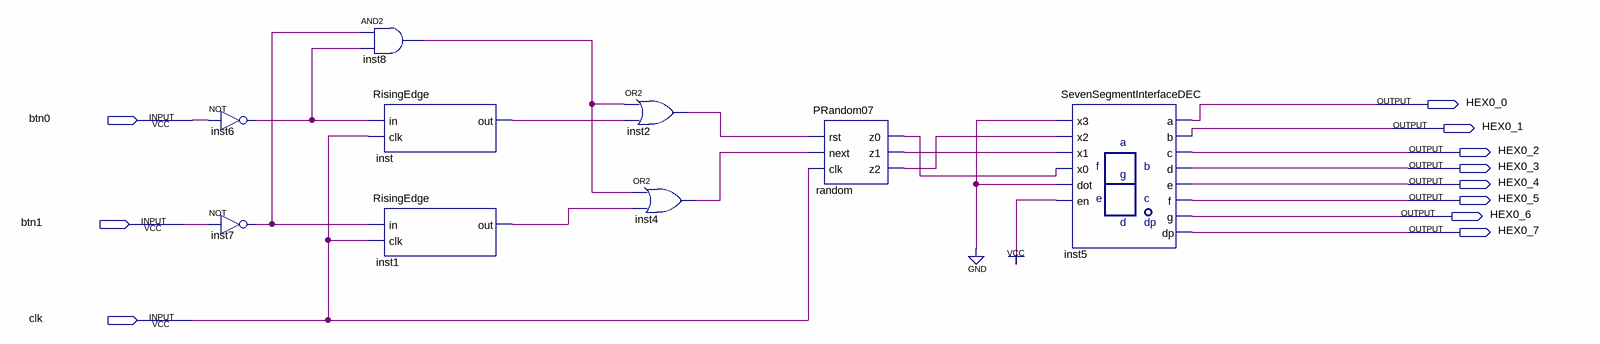
[diagram p0: schematic sheet]
// Quartus schematic PORT_2.bdf as structural Verilog: 9 symbols, 11 pins
module PORT_2 (
  input  btn0,
  input  btn1,
  input  clk,
  output HEX0_0,
  output HEX0_1,
  output HEX0_2,
  output HEX0_3,
  output HEX0_4,
  output HEX0_5,
  output HEX0_6,
  output HEX0_7
);

  wire inst1_output, inst2_out, inst4_out, inst6_out, inst7_out, inst8_out, inst_output, random_z0,
       random_z1, random_z2;

  not inst6 (inst6_out, btn0);
  not inst7 (inst7_out, btn1);
  and inst8 (inst8_out, inst7_out, inst6_out);
  RisingEdge inst (.clk(clk), .\input (inst6_out), .\output (inst_output));
  RisingEdge inst1 (.clk(clk), .\input (inst7_out), .\output (inst1_output));
  or inst2 (inst2_out, inst8_out, inst_output);
  or inst4 (inst4_out, inst8_out, inst1_output);
  PRandom07 random (.rst(inst2_out), .next(inst4_out), .clk(clk), .z0(random_z0), .z1(random_z1), .z2(random_z2));
  SevenSegmentInterfaceDEC inst5 (
    .x3(1'b0), .x2(random_z2), .x1(random_z1), .x0(random_z0), .dot(1'b0), .en(1'b1), .a(HEX0_0), .b(HEX0_1),
    .c(HEX0_2), .d(HEX0_3), .e(HEX0_4), .f(HEX0_5), .g(HEX0_6), .dp(HEX0_7));
endmodule
